# EAGLE design FAL6567g (EAGLE 7.2.0)
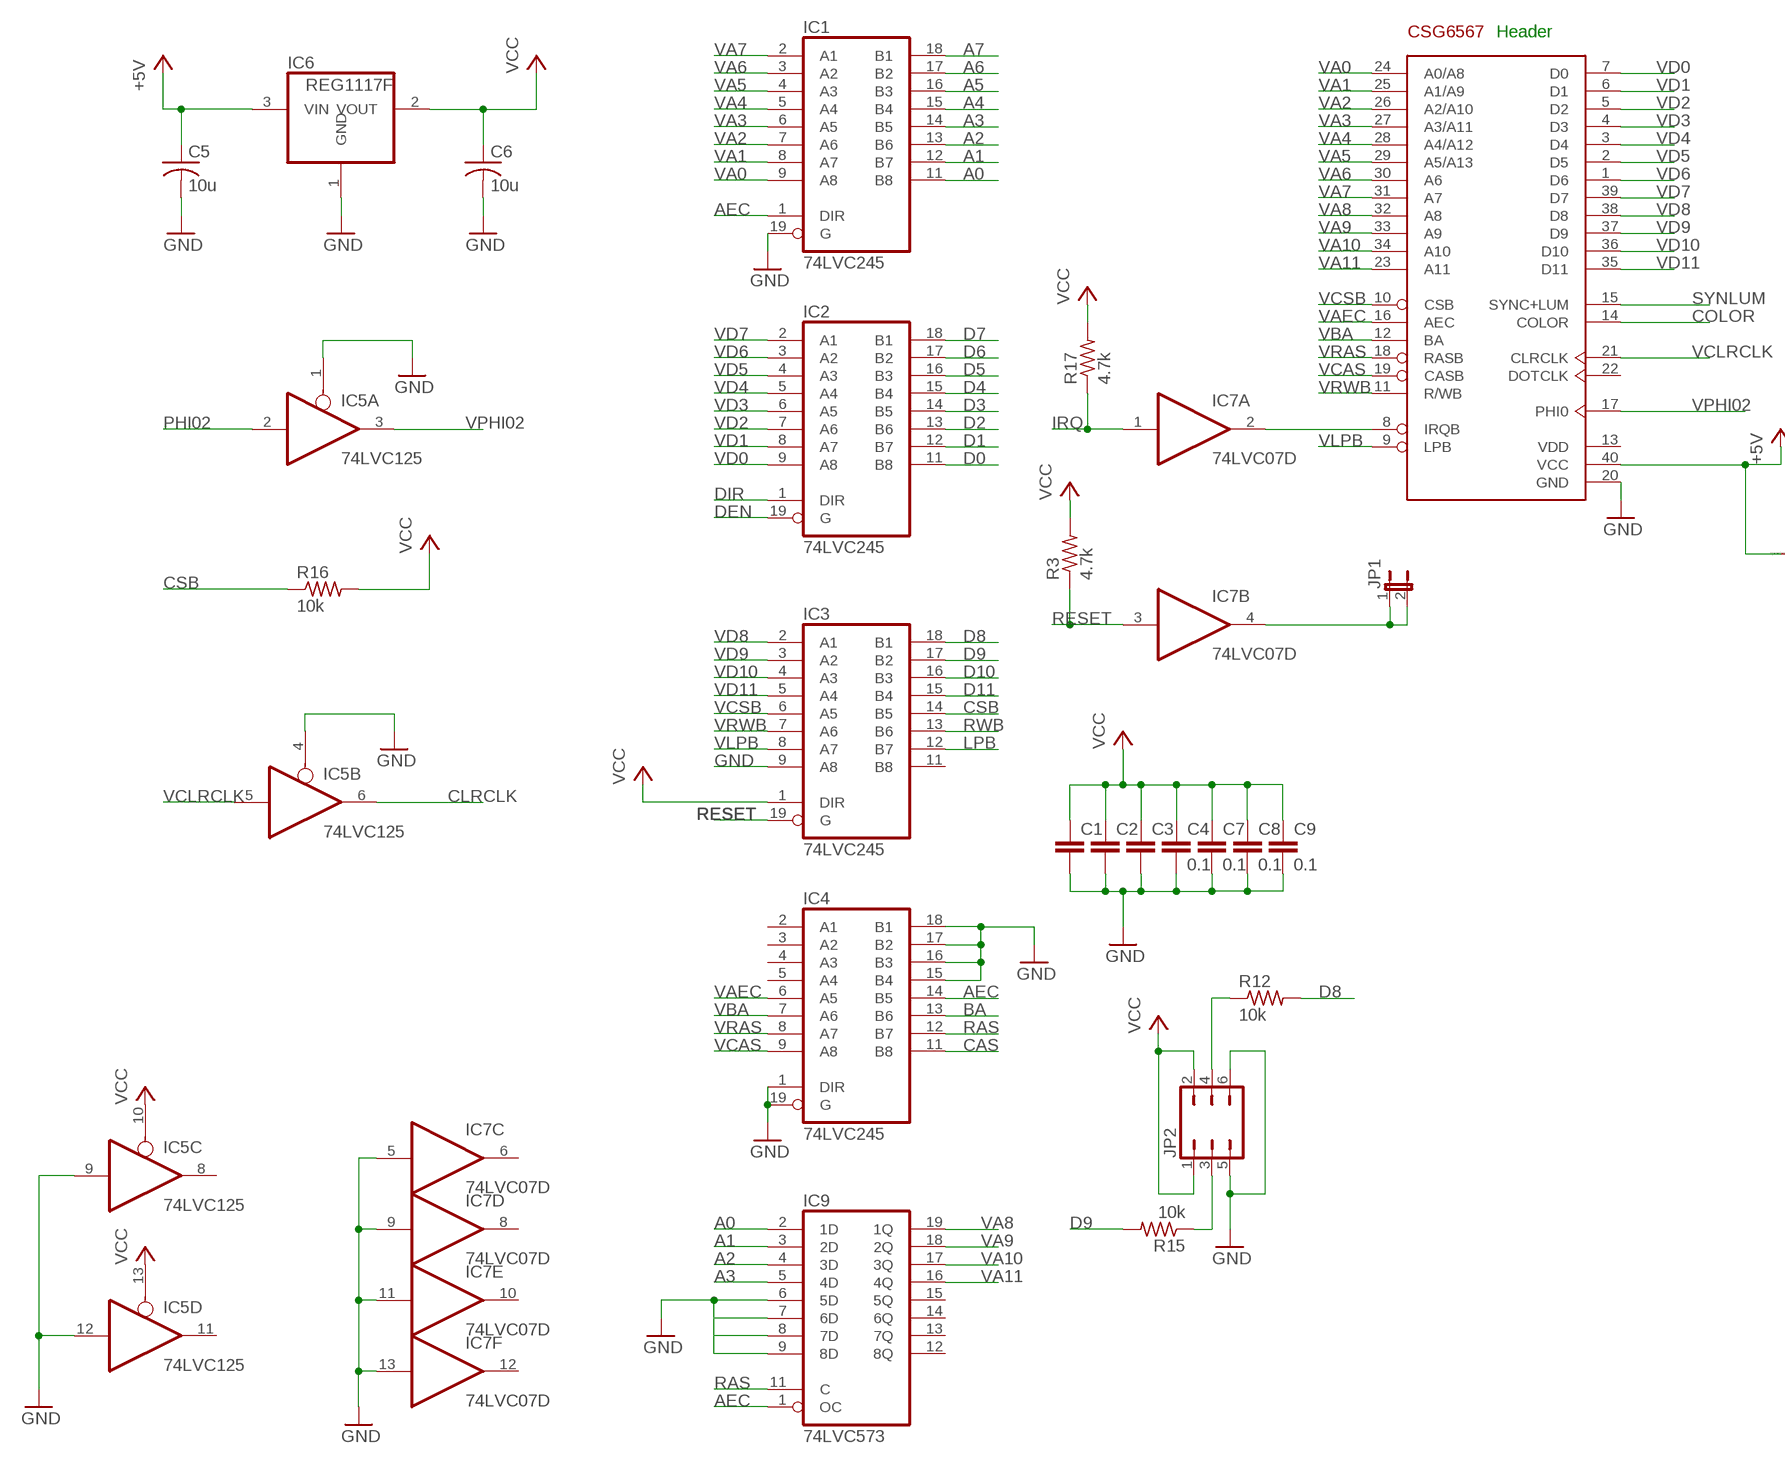
[diagram p0: schematic, sheet 1, part 1 of 2]
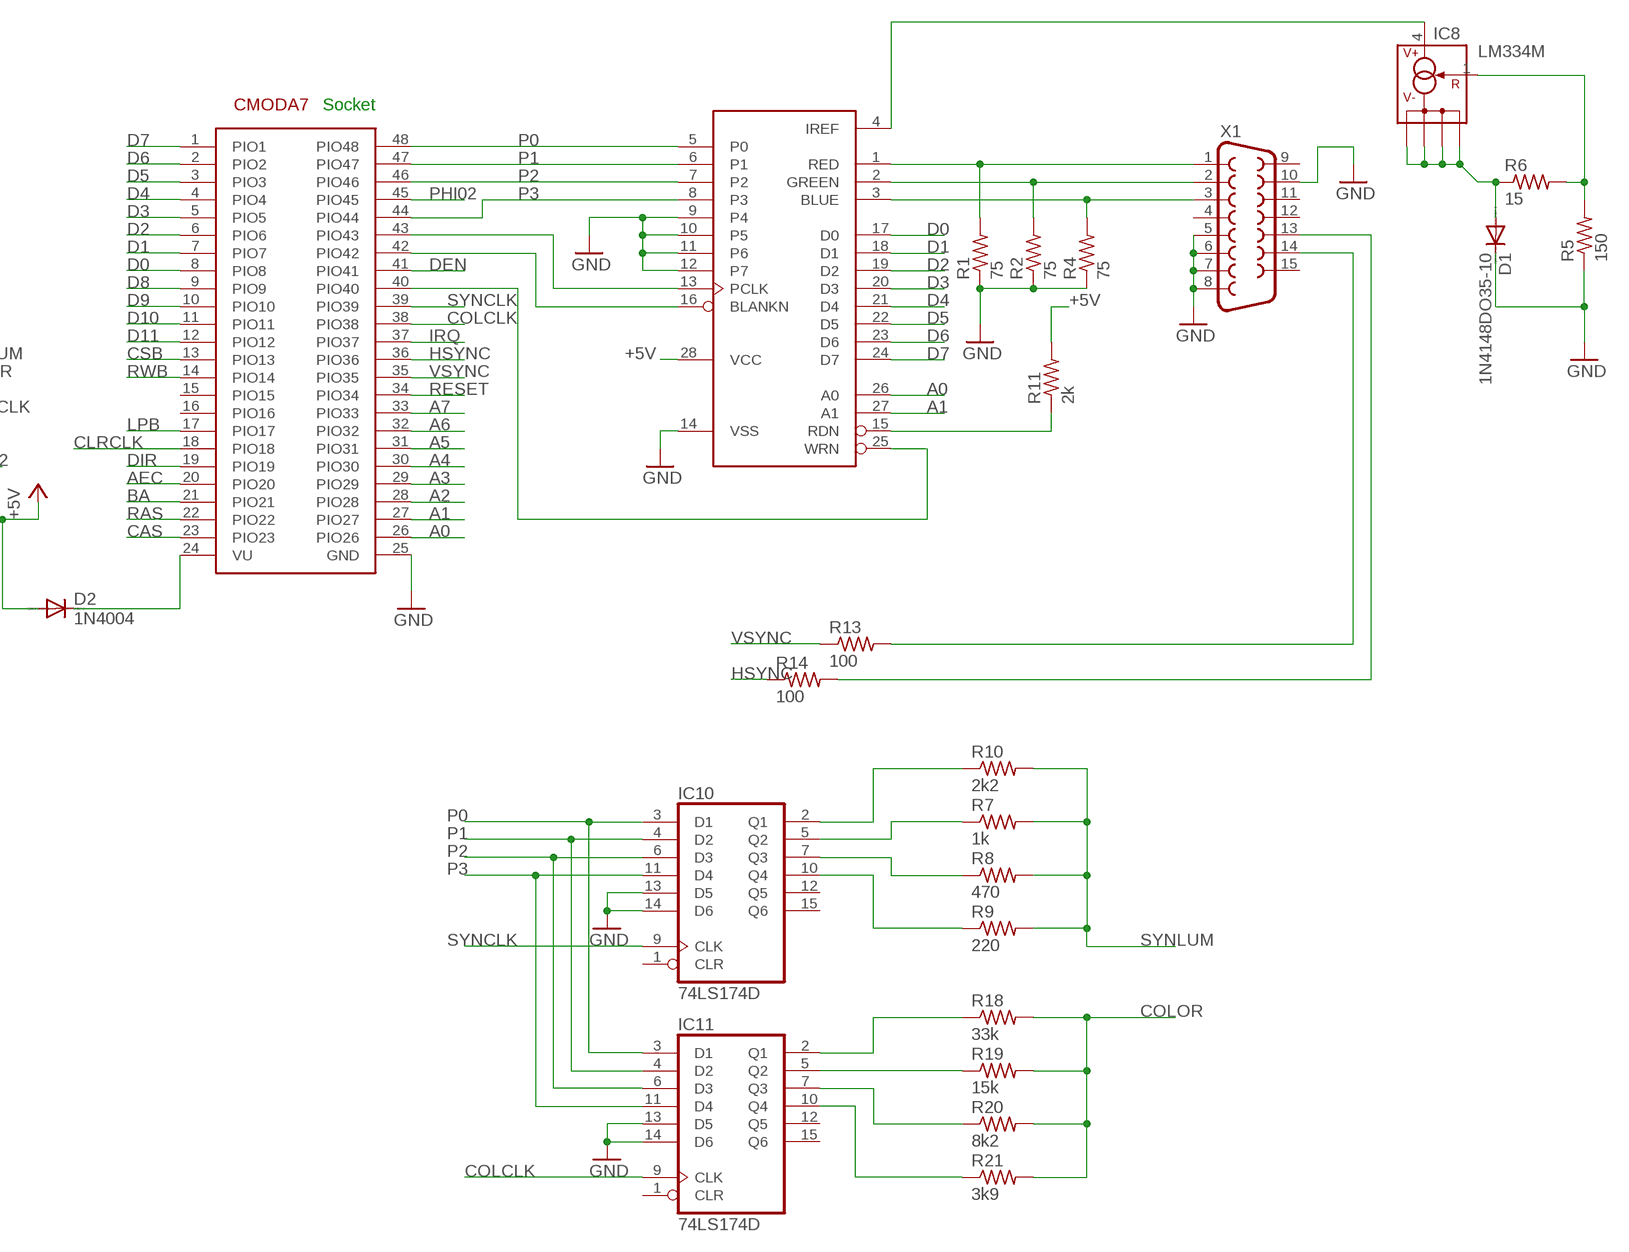
[diagram p1: schematic, sheet 1, part 2 of 2]

## Parts
C1  C-EU050-024X044  [C050-024X044]
C2  C-EU050-024X044  [C050-024X044]
C3  C-EU050-024X044  [C050-024X044]
C4  0.1  C-EU050-024X044  [C050-024X044]
C5  10u  C-USC1206  [C1206]
C6  10u  C-USC1206  [C1206]
C7  0.1  C-EU050-024X044  [C050-024X044]
C8  0.1  C-EU050-024X044  [C050-024X044]
C9  0.1  C-EU050-024X044  [C050-024X044]
D1  1N4148DO35-10  [DO35-10]
D2  1N4004  [DO41-10]
IC1  74LVC245  74LS245DW  [SO20W]
IC2  74LVC245  74LS245DW  [SO20W]
IC3  74LVC245  74LS245DW  [SO20W]
IC4  74LVC245  74LS245DW  [SO20W]
IC5  74LVC125  [SO14]
IC6  REG1117F  [DD-3]
IC7  74LVC07D  74LS07D  [SO14]
IC8  LM334M  [SO08]
IC9  74LVC573  [SO20W]
IC10  74LS174D  [SO16]
IC11  74LS174D  [SO16]
JP1  JP1E  [JP1]
JP2  JP3Q  [JP3Q]
R1  75  R-US_0204/7  [0204/7]
R2  75  R-US_0204/7  [0204/7]
R3  4.7k  R-US_0204/7  [0204/7]
R4  75  R-US_0204/7  [0204/7]
R5  150  R-US_0204/7  [0204/7]
R6  15  R-US_0204/7  [0204/7]
R7  1k  R-US_0204/7  [0204/7]
R8  470  R-US_0204/7  [0204/7]
R9  220  R-US_0204/7  [0204/7]
R10  2k2  R-US_0204/7  [0204/7]
R11  2k  R-US_0204/7  [0204/7]
R12  10k  R-US_0204/7  [0204/7]
R13  100  R-US_0204/7  [0204/7]
R14  100  R-US_0204/7  [0204/7]
R15  10k  R-US_0204/7  [0204/7]
R16  10k  R-US_0204/7  [0204/7]
R17  4.7k  R-US_0204/7  [0204/7]
R18  33k  R-US_0204/7  [0204/7]
R19  15k  R-US_0204/7  [0204/7]
R20  8k2  R-US_0204/7  [0204/7]
R21  3k9  R-US_0204/7  [0204/7]
U$1  CSG6567  [DIP-40]
U$2  CMODA7  [DIL48]
U$3  ADV476  [DIL28-6]
X1  F15HDV  [HDF15V]

## Nets
+5V: C5.1 D2.A IC6.3(VIN) R11.2 U$1.40(VCC) U$3.28(VCC)
A0: IC1.11(B8) IC9.2(1D) U$2.26(PIO26) U$3.26(A0)
A1: IC1.12(B7) IC9.3(2D) U$2.27(PIO27) U$3.27(A1)
A2: IC1.13(B6) IC9.4(3D) U$2.28(PIO28)
A3: IC1.14(B5) IC9.5(4D) U$2.29(PIO29)
A4: IC1.15(B4) U$2.30(PIO30)
A5: IC1.16(B3) U$2.31(PIO31)
A6: IC1.17(B2) U$2.32(PIO32)
A7: IC1.18(B1) U$2.33(PIO33)
AEC: IC1.1(DIR) IC4.14(B5) IC9.1(OC) U$2.20(PIO20)
BA: IC4.13(B6) U$2.21(PIO21)
CAS: IC4.11(B8) U$2.23(PIO23)
CLRCLK: IC5.6(B:O) U$2.18(PIO18)
COLCLK: IC11.9(CLK) U$2.38(PIO38)
COLOR: R18.2 R19.2 R20.2 R21.2 U$1.14(COLOR)
CSB: IC3.14(B5) R16.1 U$2.13(PIO13)
D0: IC2.11(B8) U$2.8(PIO8) U$3.17(D0)
D1: IC2.12(B7) U$2.7(PIO7) U$3.18(D1)
D2: IC2.13(B6) U$2.6(PIO6) U$3.19(D2)
D3: IC2.14(B5) U$2.5(PIO5) U$3.20(D3)
D4: IC2.15(B4) U$2.4(PIO4) U$3.21(D4)
D5: IC2.16(B3) U$2.3(PIO3) U$3.22(D5)
D6: IC2.17(B2) U$2.2(PIO2) U$3.23(D6)
D7: IC2.18(B1) U$2.1(PIO1) U$3.24(D7)
D8: IC3.18(B1) R12.2 U$2.9(PIO9)
D9: IC3.17(B2) R15.2 U$2.10(PIO10)
D10: IC3.16(B3) U$2.11(PIO11)
D11: IC3.15(B4) U$2.12(PIO12)
DEN: IC2.19(G) U$2.41(PIO41)
DIR: IC2.1(DIR) U$2.19(PIO19)
GND: C1.2 C2.2 C3.2 C4.2 C5.2 C6.2 C7.2 C8.2 C9.2 D1.C IC1.19(G) IC3.9(A8) IC4.1(DIR) IC4.15(B4) IC4.16(B3) IC4.17(B2) IC4.18(B1) IC4.19(G) IC5.1(A:OE) IC5.4(B:OE) IC5.9(C:I) IC5.12(D:I) IC6.1(GND) IC7.5(C:I) IC7.9(D:I) IC7.11(E:I) IC7.13(F:I) IC9.6(5D) IC9.9(8D) IC10.13(D5) IC10.14(D6) IC11.13(D5) IC11.14(D6) JP2.5 JP2.6 R1.1 R2.1 R4.1 R5.1 U$1.20(GND) U$2.25(GND) U$3.9(P4) U$3.10(P5) U$3.11(P6) U$3.12(P7) U$3.14(VSS) X1.5 X1.6 X1.7 X1.8 X1.10
HSYNC: R14.1 U$2.36(PIO36)
IRQ: IC7.1(A:I) R17.1 U$2.37(PIO37)
LPB: IC3.12(B7) U$2.17(PIO17)
MD0: JP2.4 R12.1
MD1: JP2.3 R15.1
N$1: IC7.2(A:O) U$1.8(IRQB)
N$2: IC10.2(Q1) R10.1
N$3: IC9.7(6D)
N$4: D2.C U$2.24(VU)
N$5: IC9.8(7D)
N$6: IC10.5(Q2) R7.1
N$7: R1.2 U$3.1(RED) X1.1
N$8: IC7.4(B:O) JP1.1 JP1.2
N$9: IC10.7(Q3) R8.1
N$10: R2.2 U$3.2(GREEN) X1.2
N$11: IC10.10(Q4) R9.1
N$12: R14.2 X1.13
N$13: R13.2 X1.14
N$14: U$2.40(PIO40) U$3.25(WRN)
N$15: R4.2 U$3.3(BLUE) X1.3
N$16: IC8.1(R) R5.2 R6.2
N$17: IC11.2(Q1) R18.1
N$18: IC11.5(Q2) R19.1
N$19: D1.A IC8.2(V-) IC8.3(V-) IC8.6(V-) IC8.7(V-) R6.1
N$21: IC8.4(V+) U$3.4(IREF)
N$23: IC11.7(Q3) R20.1
N$24: U$2.43(PIO43) U$3.13(PCLK)
N$25: U$2.42(PIO42) U$3.16(BLANKN)
N$26: IC11.10(Q4) R21.1
N$28: R11.1 U$3.15(RDN)
P0: IC10.3(D1) IC11.3(D1) U$2.48(PIO48) U$3.5(P0)
P1: IC10.4(D2) IC11.4(D2) U$2.47(PIO47) U$3.6(P1)
P2: IC10.6(D3) IC11.6(D3) U$2.46(PIO46) U$3.7(P2)
P3: IC10.11(D4) IC11.11(D4) U$2.44(PIO44) U$3.8(P3)
PHI02: IC5.2(A:I) U$2.45(PIO45)
RAS: IC4.12(B7) IC9.11(C) U$2.22(PIO22)
RESET: IC3.19(G) IC7.3(B:I) R3.1 U$2.34(PIO34)
RWB: IC3.13(B6) U$2.14(PIO14)
SYNCLK: IC10.9(CLK) U$2.39(PIO39)
SYNLUM: R7.2 R8.2 R9.2 R10.2 U$1.15(SYNC+LUM)
VA0: IC1.9(A8) U$1.24(A0/A8)
VA1: IC1.8(A7) U$1.25(A1/A9)
VA2: IC1.7(A6) U$1.26(A2/A10)
VA3: IC1.6(A5) U$1.27(A3/A11)
VA4: IC1.5(A4) U$1.28(A4/A12)
VA5: IC1.4(A3) U$1.29(A5/A13)
VA6: IC1.3(A2) U$1.30(A6)
VA7: IC1.2(A1) U$1.31(A7)
VA8: IC9.19(1Q) U$1.32(A8)
VA9: IC9.18(2Q) U$1.33(A9)
VA10: IC9.17(3Q) U$1.34(A10)
VA11: IC9.16(4Q) U$1.23(A11)
VAEC: IC4.6(A5) U$1.16(AEC)
VBA: IC4.7(A6) U$1.12(BA)
VCAS: IC4.9(A8) U$1.19(CASB)
VCC: C1.1 C2.1 C3.1 C4.1 C6.1 C7.1 C8.1 C9.1 IC3.1(DIR) IC5.10(C:OE) IC5.13(D:OE) IC6.2(VOUT) JP2.1 JP2.2 R3.2 R16.2 R17.2
VCLRCLK: IC5.5(B:I) U$1.21(CLRCLK)
VCSB: IC3.6(A5) U$1.10(CSB)
VD0: IC2.9(A8) U$1.7(D0)
VD1: IC2.8(A7) U$1.6(D1)
VD2: IC2.7(A6) U$1.5(D2)
VD3: IC2.6(A5) U$1.4(D3)
VD4: IC2.5(A4) U$1.3(D4)
VD5: IC2.4(A3) U$1.2(D5)
VD6: IC2.3(A2) U$1.1(D6)
VD7: IC2.2(A1) U$1.39(D7)
VD8: IC3.2(A1) U$1.38(D8)
VD9: IC3.3(A2) U$1.37(D9)
VD10: IC3.4(A3) U$1.36(D10)
VD11: IC3.5(A4) U$1.35(D11)
VLPB: IC3.8(A7) U$1.9(LPB)
VPHI02: IC5.3(A:O) U$1.17(PHI0)
VRAS: IC4.8(A7) U$1.18(RASB)
VRWB: IC3.7(A6) U$1.11(R/WB)
VSYNC: R13.1 U$2.35(PIO35)
Unconnected: IC3.11(B8) IC4.2(A1) IC4.3(A2) IC4.4(A3) IC4.5(A4) IC5.8(C:O) IC5.11(D:O) IC7.6(C:O) IC7.8(D:O) IC7.10(E:O) IC7.12(F:O) IC9.12(8Q) IC9.13(7Q) IC9.14(6Q) IC9.15(5Q) IC10.1(CLR) IC10.12(Q5) IC10.15(Q6) IC11.1(CLR) IC11.12(Q5) IC11.15(Q6) U$1.22(DOTCLK) U$2.15(PIO15) U$2.16(PIO16) X1.4 X1.9 X1.11 X1.12 X1.15

## Notes on the sheet
- Header
- Socket

## Power pins joined to a net without a drawn wire
GND: IC1.10(GND) IC2.10(GND) IC3.10(GND) IC4.10(GND) IC5.7(P:GND) IC7.7(P:GND) IC9.10(GND) IC10.8(GND) IC11.8(GND)
VCC: IC1.20(VCC) IC2.20(VCC) IC3.20(VCC) IC4.20(VCC) IC5.14(P:VCC) IC7.14(P:VCC) IC9.20(VCC) IC10.16(VCC) IC11.16(VCC)
VDD: U$1.13(VDD)

## Library data of the parts
C1-C4 C7-C9 = resistor:C-EU: CAPACITOR, European symbol
C5 C6 = resistor:C-US: CAPACITOR, American symbol
D1 = diode:1N4148: DIODE high speed (Philips)
D2 = diode:1N4004: DIODE general purpose rectifier, 1 A
IC1-IC4 = FT74xx:74*245: Octal BUS TRANSCEIVER, 3-state
IC5 = FT74xx:74*125: Quad bus BUFFER, 3-state
IC6 = burr-brown:REG1117: 800mA and 1A Low Dropout (LDO) Positive Regulator 1.8V, 2.5V, 2.85V, 3.3V, 5V, and Adj; MF: TEXAS INSTRUMENTS; MPN: REG1117FAKTTT; OC_FARNELL: 1296120; OC_NEWARK: 87H2562
IC7 = FT74xx:74*07: Hex BUFFER, open collector high-voltage output
IC8 = linear:LM334*: 3-Terminal Adjustable Current Sources Source: www.national.com/pf/LM/LM334.html | LM134.pdf
IC9 = FT74xx:74*573: 8-bit D latch BUS DRIVER
IC10 IC11 = FT74xx:74*174: Hex D type FLIP FLOP, clear
JP1 = jumper:JP1E: JUMPER
JP2 = jumper:JP3Q: JUMPER
R1-R21 = resistor:R-US_: RESISTOR, American symbol
U$1 = 65xxx:CSG6567
U$2 = FT74xx:CMODA7
U$3 = FT74xx:ADV476: color palette
X1 = con-subd:F15: SUB-D; OC_FARNELL: unknown; OC_NEWARK: unknown

## Board
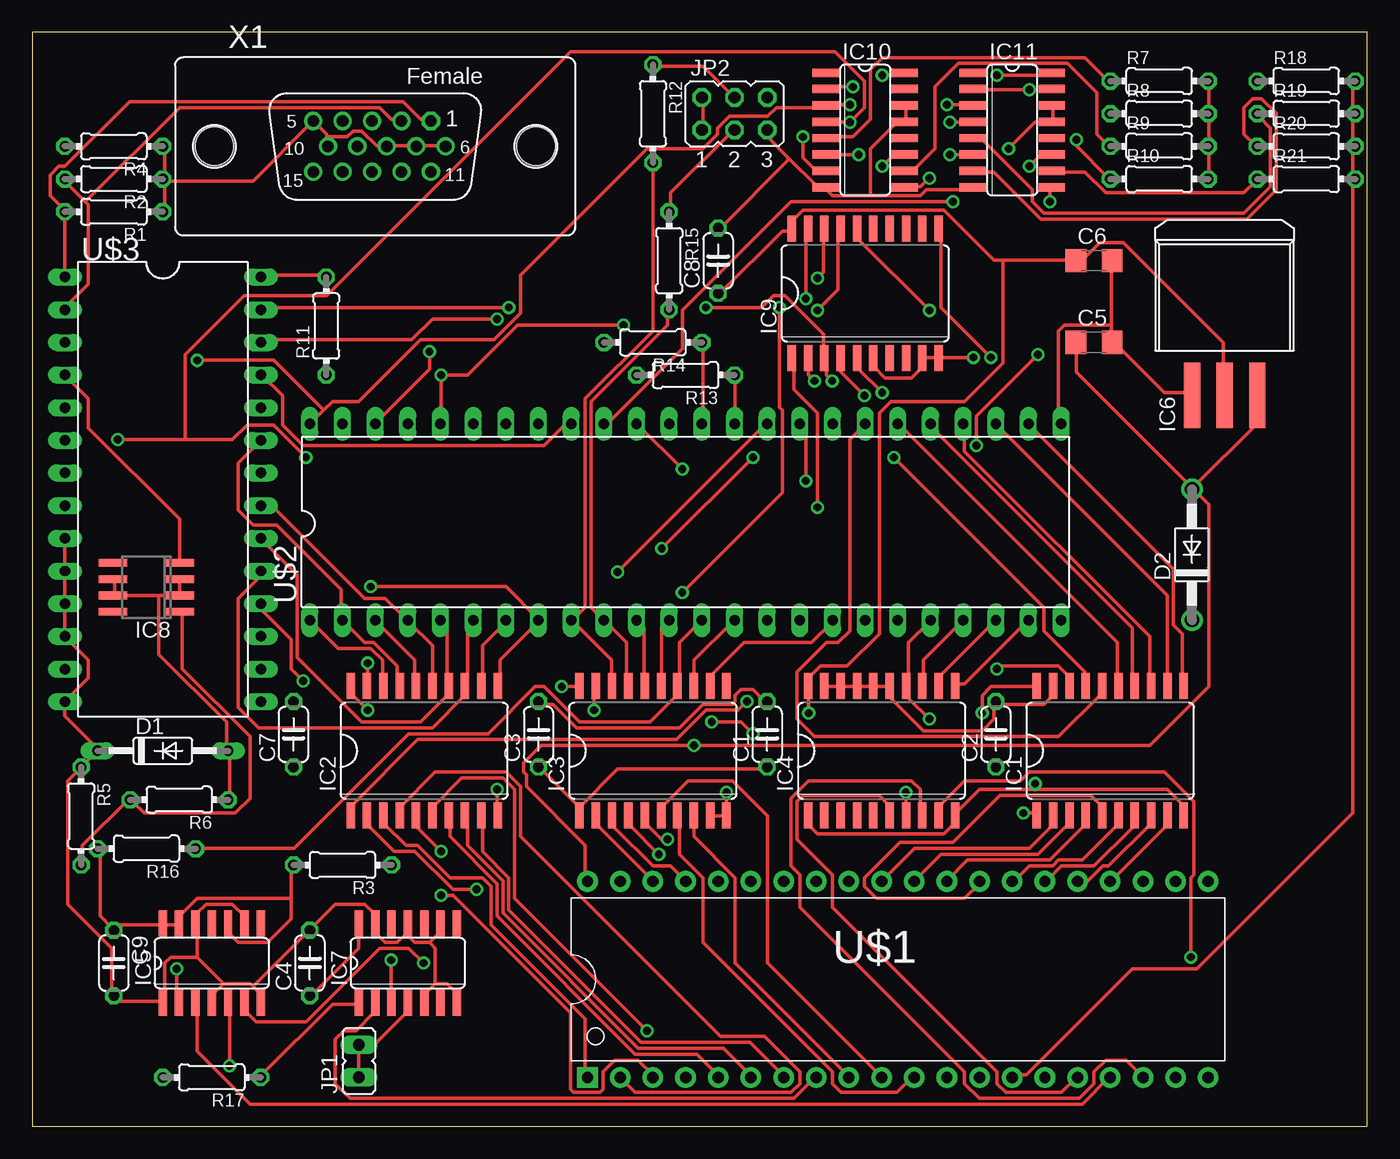
[diagram p2: board, top side]
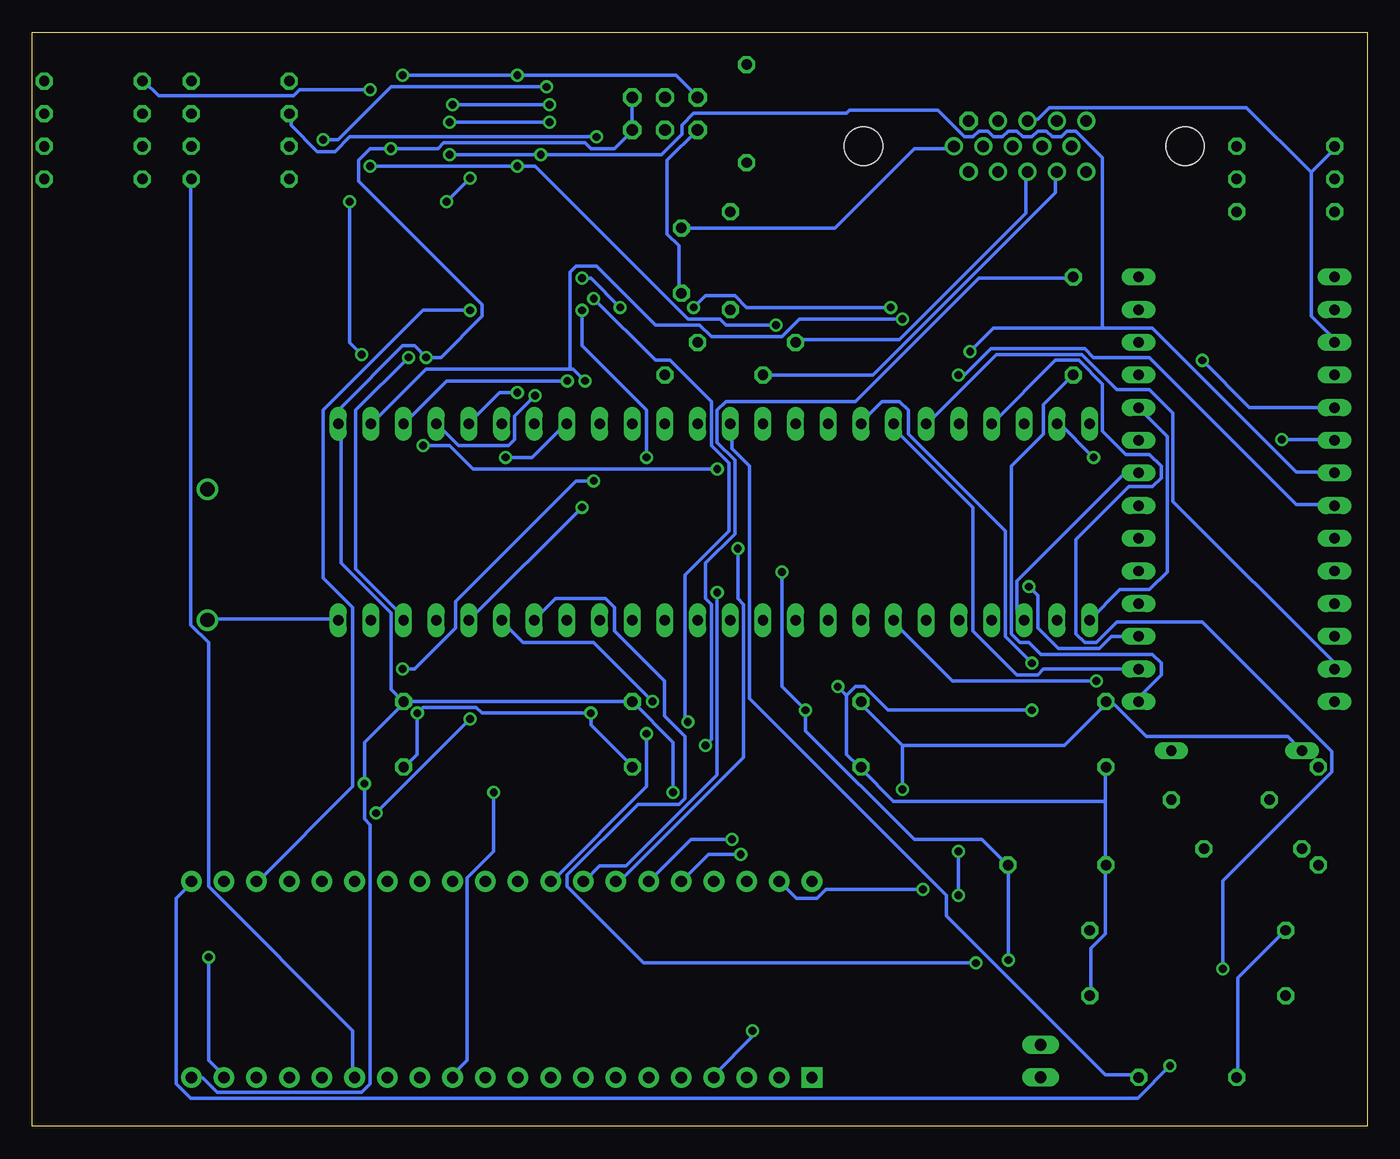
[diagram p3: board, bottom side, seen from below]

Size 103.81 x 85.08 mm. Coordinates in mm from the lower left corner, seen from the top.
Outline: 0,0 103.81,0 103.81,85.08 0,85.08 0,0
Copper layers (1*16): Top 0.035mm / dielectric 1.5mm / Bottom 0.035mm
Design rules "default": minimum track width 10mil, minimum drill 24mil, track to track 8mil, track to pad 8mil, pad to pad 8mil, via to via 8mil, smd to smd 8mil, copper to edge 40mil, drill to drill 8mil, minimum pad ring 10mil, minimum via ring 8mil, stop-mask expansion 4mil, vias tented up to drill 0mil, thermal gap 10mil

### Footprints (pad centres in the part's own frame; a part is rotated, then mirrored left to right if it is on the bottom)
C050-024X044 = drill 0.813 octagon: 1 -2.54,0; 2 2.54,0
C1206 = smd 1.6 x 1.8: 1 -1.4,0; 2 1.4,0
DO35-10 = drill 0.813 long: A 5.08,0; C -5.08,0
DO41-10 = drill 1.118: A 5.08,0; C -5.08,0
SO20W = smd 0.66 x 2.032: 1 -5.715,-5.029; 2 -4.445,-5.029; 3 -3.175,-5.029; 4 -1.905,-5.029; 5 -0.635,-5.029; 6 0.635,-5.029; 7 1.905,-5.029; 8 3.175,-5.029; 9 4.445,-5.029; 10 5.715,-5.029; 11 5.715,5.029; 12 4.445,5.029; 13 3.175,5.029; 14 1.905,5.029; 15 0.635,5.029; 16 -0.635,5.029; 17 -1.905,5.029; 18 -3.175,5.029; 19 -4.445,5.029; 20 -5.715,5.029
SO14 = smd 0.66 x 2.032: 1 -3.81,-3.073; 2 -2.54,-3.073; 3 -1.27,-3.073; 4 0,-3.073; 5 1.27,-3.073; 6 2.54,-3.073; 7 3.81,-3.073; 8 3.81,3.073; 9 2.54,3.073; 10 1.27,3.073; 11 0,3.073; 12 -1.27,3.073; 13 -2.54,3.073; 14 -3.81,3.073
DD-3 = smd 1.27 x 5.08: 1 -2.54,-7.938; 2 0,-7.938; 3 2.54,-7.938
SO08 = smd 0.6 x 2.2: 1 -1.905,-2.6; 2 -0.635,-2.6; 3 0.635,-2.6; 4 1.905,-2.6; 5 1.905,2.6; 6 0.635,2.6; 7 -0.635,2.6; 8 -1.905,2.6
SO16 = smd 0.66 x 2.032: 1 -4.445,-3.073; 2 -3.175,-3.073; 3 -1.905,-3.073; 4 -0.635,-3.073; 5 0.635,-3.073; 6 1.905,-3.073; 7 3.175,-3.073; 8 4.445,-3.073; 9 4.445,3.073; 10 3.175,3.073; 11 1.905,3.073; 12 0.635,3.073; 13 -0.635,3.073; 14 -1.905,3.073; 15 -3.175,3.073; 16 -4.445,3.073
JP1 = drill 0.914 long: 1 0,-1.27; 2 0,1.27
JP3Q = drill 0.914 octagon: 1 -2.54,-1.27; 2 -2.54,1.27; 3 0,-1.27; 4 0,1.27; 5 2.54,-1.27; 6 2.54,1.27
0204/7 = drill 0.813 octagon: 1 -3.81,0; 2 3.81,0
DIP-40 = drill 0.889 pad 1.6 square: 1 -22.86,-7.62 | drill 0.889 pad 1.6: 2 -20.32,-7.62; 3 -17.78,-7.62; 4 -15.24,-7.62; 5 -12.7,-7.62; 6 -10.16,-7.62; 7 -7.62,-7.62; 8 -5.08,-7.62; 9 -2.54,-7.62; 10 0,-7.62; 11 2.54,-7.62; 12 5.08,-7.62; 13 7.62,-7.62; 14 10.16,-7.62; 15 12.7,-7.62; 16 15.24,-7.62; 17 17.78,-7.62; 18 20.32,-7.62; 19 22.86,-7.62; 20 25.4,-7.62; 21 25.4,7.62; 22 22.86,7.62; 23 20.32,7.62; 24 17.78,7.62; 25 15.24,7.62; 26 12.7,7.62; 27 10.16,7.62; 28 7.62,7.62; 29 5.08,7.62; 30 2.54,7.62; 31 0,7.62; 32 -2.54,7.62; 33 -5.08,7.62; 34 -7.62,7.62; 35 -10.16,7.62; 36 -12.7,7.62; 37 -15.24,7.62; 38 -17.78,7.62; 39 -20.32,7.62; 40 -22.86,7.62
DIL48 = drill 0.813 long: 1 -29.21,-7.62; 2 -26.67,-7.62; 3 -24.13,-7.62; 4 -21.59,-7.62; 5 -19.05,-7.62; 6 -16.51,-7.62; 7 -13.97,-7.62; 8 -11.43,-7.62; 9 -8.89,-7.62; 10 -6.35,-7.62; 11 -3.81,-7.62; 12 -1.27,-7.62; 13 1.27,-7.62; 14 3.81,-7.62; 15 6.35,-7.62; 16 8.89,-7.62; 17 11.43,-7.62; 18 13.97,-7.62; 19 16.51,-7.62; 20 19.05,-7.62; 21 21.59,-7.62; 22 24.13,-7.62; 23 26.67,-7.62; 24 29.21,-7.62; 25 29.21,7.62; 26 26.67,7.62; 27 24.13,7.62; 28 21.59,7.62; 29 19.05,7.62; 30 16.51,7.62; 31 13.97,7.62; 32 11.43,7.62; 33 8.89,7.62; 34 6.35,7.62; 35 3.81,7.62; 36 1.27,7.62; 37 -1.27,7.62; 38 -3.81,7.62; 39 -6.35,7.62; 40 -8.89,7.62; 41 -11.43,7.62; 42 -13.97,7.62; 43 -16.51,7.62; 44 -19.05,7.62; 45 -21.59,7.62; 46 -24.13,7.62; 47 -26.67,7.62; 48 -29.21,7.62
DIL28-6 = drill 0.813 long: 1 -16.51,-7.62; 2 -13.97,-7.62; 3 -11.43,-7.62; 4 -8.89,-7.62; 5 -6.35,-7.62; 6 -3.81,-7.62; 7 -1.27,-7.62; 8 1.27,-7.62; 9 3.81,-7.62; 10 6.35,-7.62; 11 8.89,-7.62; 12 11.43,-7.62; 13 13.97,-7.62; 14 16.51,-7.62; 15 16.51,7.62; 16 13.97,7.62; 17 11.43,7.62; 18 8.89,7.62; 19 6.35,7.62; 20 3.81,7.62; 21 1.27,7.62; 22 -1.27,7.62; 23 -3.81,7.62; 24 -6.35,7.62; 25 -8.89,7.62; 26 -11.43,7.62; 27 -13.97,7.62; 28 -16.51,7.62
HDF15V = drill 0.9 octagon: 1 4.329,1.98 | drill 0.9: 2 2.043,1.98; 3 -0.243,1.98; 4 -2.529,1.98; 5 -4.815,1.98; 6 5.472,0; 7 3.186,0; 8 0.9,0; 9 -1.386,0; 10 -3.672,0; 11 4.329,-1.98; 12 2.043,-1.98; 13 -0.243,-1.98; 14 -2.529,-1.98; 15 -4.815,-1.98 | hole 3: -12.5,0; 12.5,0

### Placement (x,y rotation side)
C1  57.15,30.48 90 top
C2  74.93,30.48 90 top
C3  39.37,30.48 90 top
C4  21.59,12.7 90 top
C5  82.55,60.96 0 top
C6  82.55,67.31 0 top
C7  20.32,30.48 90 top
C8  53.34,67.31 90 top
C9  6.35,12.7 270 top
D1  10.16,29.21 0 top
D2  90.17,44.45 90 top
DRILEGEND  [DRILEGEND]  0,-7.62 0 top  (outside the outline)
IC1  83.82,29.21 0 top
IC2  30.48,29.21 0 top
IC3  48.26,29.21 0 top
IC4  66.04,29.21 0 top
IC5  13.97,12.7 0 top
IC6  92.71,64.77 0 top
IC7  29.21,12.7 0 top
IC8  8.89,41.91 90 top
IC9  64.77,64.77 0 top
IC10  64.77,77.47 270 top
IC11  76.2,77.47 270 top
JP1  25.4,5.08 0 top
JP2  54.61,78.74 0 top
R1  6.35,71.12 180 top
R2  6.35,73.66 180 top
R3  24.13,20.32 180 top
R4  6.35,76.2 180 top
R5  3.81,24.13 270 top
R6  11.43,25.4 180 top
R7  87.63,81.28 0 top
R8  87.63,78.74 0 top
R9  87.63,76.2 0 top
R10  87.63,73.66 0 top
R11  22.86,62.23 90 top
R12  48.26,78.74 270 top
R13  50.8,58.42 180 top
R14  48.26,60.96 180 top
R15  49.53,67.31 270 top
R16  8.89,21.59 180 top
R17  13.97,3.81 180 top
R18  99.06,81.28 0 top
R19  99.06,78.74 0 top
R20  99.06,76.2 0 top
R21  99.06,73.66 0 top
U$1  66.04,11.43 0 top
U$2  50.8,46.99 0 top
U$3  10.16,49.53 270 top
X1  26.67,76.2 0 top

### Tracks (layer width: path | path; a pad name or v marks a point on that pad's centre or on a via)
+5V  (via drill 0.61)
  Top 0.254: U$3.28 17.86,66.19 22.66,66.19 R11.2 | C5.1 81.18,60.94 81.18,58.65 90.09,49.73 D2.A | U$1.40 43,19.1 43,21.84 38.43,26.42 38.43,27.33 38.2,27.56 38.2,28.25 39.57,29.62 v51.46,29.62 86.89,29.62 91.47,34.19 91.47,48.36 90.32,49.51 D2.A | IC6.3 95.12,56.82 95.12,54.53 90.32,49.73 D2.A
  Bottom 0.254: v51.46,29.62 51,30.07 51,40.59 51.46,41.05 51.46,43.79 49.17,46.08 49.17,51.79 50.55,53.16 50.55,55.68 49.86,56.36 39.8,56.36 30.2,65.96 22.88,65.96 R11.2
A0  (via drill 0.61)
  Top 0.254: v60.83,57.96 60.38,58.42 60.38,59.56 IC9.2 | IC1.11 89.41,34.42 89.41,38.3 88.72,38.99 88.72,43.33 77.52,54.53 U$2.26 | v36.14,62.76 31.11,62.76 29.52,61.16 17.86,61.16 U$3.26
  Bottom 0.254: v60.83,57.96 61.75,58.88 61.98,58.88 | 61.98,58.88 73.18,58.88 77.29,54.76 U$2.26 | v36.14,62.76 44.14,62.76 45.52,61.39 51,61.39 51.92,62.31 55.35,62.31 59.92,66.88 61.52,66.88 61.98,66.42 61.98,58.88
A1  (via drill 0.61)
  Top 0.254: IC1.12 88.27,41.28 U$2.27 | v62.2,57.96 61.75,58.42 61.75,59.56 IC9.3 61.52,59.79 61.52,61.62 58.55,64.59 57.63,64.59 56.72,63.68 v52.38,63.68 | v37.06,63.68 17.86,63.68 U$3.27
  Bottom 0.254: v62.2,57.96 71.58,57.96 U$2.27 | v37.06,63.68 48.26,63.68 49.17,64.59 51.46,64.59 v52.38,63.68
A2  (via drill 0.61)
  Top 0.254: IC1.13 86.89,34.42 86.89,38.08 72.49,52.48 72.49,54.53 U$2.28 | v64.72,56.82 62.89,58.65 62.89,59.56 IC9.4
  Bottom 0.254: v64.72,56.82 66.32,55.22 66.32,53.39 66.78,52.93 70.66,52.93 72.26,54.53 U$2.28
A3  (via drill 0.61)
  Top 0.254: IC1.14 85.52,34.42 85.52,38.76 69.75,54.53 U$2.29 | v66.09,57.05 64.26,58.88 64.26,59.56 IC9.5
  Bottom 0.254: v66.09,57.05 67.46,57.05 69.75,54.76 U$2.29
A4
  Top 0.254: IC1.15 84.38,34.42 84.38,37.62 67.46,54.53 U$2.30
A5
  Top 0.254: IC1.16 83.01,34.19 83.01,33.5 79.81,30.3 60.83,30.3 59.46,31.67 59.46,35.33 61.75,37.62 62.66,37.62 63.58,38.53 63.58,53.39 64.72,54.53 U$2.31
A6  (via drill 0.61)
  Top 0.254: v67.01,52.02 78.66,40.36 78.66,38.53 81.86,35.33 81.86,34.42 IC1.17
  Bottom 0.254: v67.01,52.02 64.95,52.02 62.43,54.53 U$2.32
A7  (via drill 0.61)
  Top 0.254: v75.01,35.56 75.23,35.79 79.81,35.79 80.49,35.1 80.49,34.42 IC1.18 | v60.15,50.19 60.15,54.08 59.69,54.53 U$2.33
  Bottom 0.254: v75.01,35.56 74.09,35.56 70.89,38.76 70.89,40.82 61.52,50.19 v60.15,50.19
AEC  (via drill 0.61)
  Top 0.254: U$2.20 69.75,39.22 68.15,37.62 68.15,34.42 IC4.14 68.15,34.19 68.15,33.27 v69.75,31.67 | v77.06,24.36 77.98,24.36 IC1.1 | v61.06,48.13 61.06,55.45 59.23,57.28 59.23,59.56 IC9.1
  Bottom 0.254: v69.75,31.67 v77.06,24.36 | v61.06,48.13 69.75,39.45 U$2.20
BA
  Top 0.254: IC4.13 69.29,34.42 69.29,36.25 72.26,39.22 U$2.21
CAS
  Top 0.254: IC4.11 71.81,34.42 72.49,34.42 77.29,39.22 U$2.23
CLRCLK  (via drill 0.61)
  Top 0.254: v30.43,12.7 29.29,13.84 27,13.84 21.29,8.13 17.4,8.13 16.71,8.81 16.71,9.5 IC5.6
  Bottom 0.254: v30.43,12.7 56.26,12.7 62.2,18.64 62.2,19.56 56.72,25.04 53.52,25.04 53.06,25.5 53.06,30.3 54.66,31.9 54.66,34.65 58.55,38.53 58.55,40.36 59.23,41.05 63.12,41.05 64.72,39.45 U$2.18
COLCLK  (via drill 0.61)
  Top 0.254: v79.12,71.91 79.12,72.82 IC11.9 | v78.21,60.02 73.41,55.22 v73.41,52.93 | v50.55,51.11 47.12,54.53 U$2.38
  Bottom 0.254: v79.12,71.91 79.12,60.94 v78.21,60.02 | v73.41,52.93 71.35,52.93 69.52,51.11 v50.55,51.11
COLOR
  Top 0.254: R18.2 102.67,81.28 102.67,78.77 R19.2 102.67,78.54 102.67,76.25 R20.2 102.67,76.02 102.67,73.74 R21.2 102.67,73.51 102.67,24.36 90.55,12.24 85.52,12.24 77.29,4.01 76.38,4.01 U$1.14
CSB
  Top 0.254: U$2.13 50.32,37.62 50.32,34.42 IC3.14 50.09,34.19 50.09,33.5 48.03,31.45 42.55,31.45 39.8,34.19 39.12,34.19 35.46,30.53 29.29,30.53 20.37,21.61 12.83,21.61 R16.1
D0  (via drill 0.61)
  Top 0.254: IC2.11 36.37,34.42 36.37,36.25 39.34,39.22 U$2.8 39.34,39.45 36.83,41.96 v26.31,41.96
  Bottom 0.254: v26.31,41.96 25.63,41.28 25.63,38.76 24.03,37.16 20.83,37.16 19.91,38.08 17.86,38.08 U$3.17
D1  (via drill 0.61)
  Top 0.254: IC2.12 35,34.42 35,37.39 36.83,39.22 U$2.7 | v21.06,34.65 20.14,35.56 20.14,37.85 17.86,40.13 17.86,40.59 U$3.18
  Bottom 0.254: v21.06,34.65 32.26,34.65 36.83,39.22 U$2.7
D2
  Top 0.254: U$2.6 34.09,39.22 33.86,38.99 33.86,34.42 IC2.13 33.63,34.19 33.63,33.5 31.11,30.99 17.63,30.99 16.03,32.59 16.03,41.05 17.63,42.65 17.63,43.1 U$3.19
D3
  Top 0.254: U$2.5 31.8,39.22 32.26,38.76 32.26,34.42 IC2.14 32.26,34.19 32.26,33.5 30.2,31.45 25.63,31.45 20.6,36.47 20.6,42.88 17.86,45.62 U$3.20
D4
  Top 0.254: IC2.15 31.11,37.39 29.29,39.22 U$2.4 29.06,39.45 27.46,41.05 25.86,41.05 18.77,48.13 17.86,48.13 U$3.21
D5
  Top 0.254: IC2.16 29.74,34.42 29.74,36.25 26.77,39.22 U$2.3
  Bottom 0.254: U$3.22 17.86,50.65 19,50.65 27.23,42.42 27.23,39.9 26.77,39.45 U$2.3
D6
  Top 0.254: IC2.17 28.37,34.42 28.37,35.79 26.54,37.62 25.86,37.62 24.26,39.22 U$2.2 24.03,39.45 24.03,41.73 19,46.76 17.17,46.76 16.03,47.9 16.03,51.56 17.63,53.16 U$3.23
D7
  Top 0.254: U$2.1 23.8,37.16 26.31,37.16 27.23,36.25 27.23,34.42 IC2.18
  Bottom 0.254: U$2.1 19.23,41.73 16.94,41.73 15.57,43.1 15.57,53.62 17.63,55.68 U$3.24
D8
  Top 0.254: IC3.18 45.06,34.42 45.06,36.25 42.09,39.22 U$2.9 42.09,39.45 43,40.36 43,56.59 48.26,61.85 R12.2
D9
  Top 0.254: IC3.17 46.2,34.42 46.2,37.62 U$2.10 43.46,40.36 43.46,56.36 49.4,62.31 49.4,63.45 R15.2
D10
  Top 0.254: IC3.16 47.57,34.42 47.57,38.76 47.12,39.22 U$2.11
D11
  Top 0.254: IC3.15 48.95,34.42 48.95,38.76 49.4,39.22 U$2.12
DEN  (via drill 0.61)
  Top 0.254: v26.09,36.02 26.09,34.42 IC2.19
  Bottom 0.254: v26.09,36.02 28.14,38.08 28.14,46.3 35.69,53.85 35.69,55.68 36.37,56.36 37.74,56.36 39.34,54.76 U$2.41
DIR  (via drill 0.61)
  Top 0.254: v55.57,33.05 54.89,32.36 52.38,32.36 50.09,30.07 29.97,30.07 24.94,25.04 24.94,24.36 IC2.1
  Bottom 0.254: v55.57,33.05 60.15,37.62 65.63,37.62 67.23,39.22 U$2.19
GND  (via drill 0.61)
  Top 0.254: 10.31,73.51 10.31,71.22 R1.1 | R4.1 10.31,76.02 10.31,73.74 R2.1 10.31,73.51 | 22.88,76.94 22.88,77.16 21.97,78.08 X1.5 21.74,78.08 17.17,73.51 10.31,73.51 | 22.88,76.94 22.88,76.25 X1.10 | X1.6 32.03,76.25 29.97,76.25 X1.7 29.74,76.25 27.69,76.25 X1.8 27.46,76.25 26.77,76.25 25.63,77.39 24.94,77.39 24.49,76.94 22.88,76.94 | IC11.14 79.35,79.22 79.35,78.31 IC11.13 79.12,78.08 77.98,78.08 v75.92,76.02 | IC10.14 67.92,79.22 67.92,78.31 IC10.13 67.69,78.08 67.23,78.08 65.18,76.02 65.18,72.36 | 58.78,75.34 57.17,76.94 57.17,77.39 JP2.5 | 58.78,75.34 61.06,73.05 61.52,73.05 IC10.8 61.75,72.82 62.2,72.36 65.18,72.36 | 65.18,72.36 69.06,72.36 69.52,72.82 72.95,72.82 IC11.8 | 58.78,75.34 58.78,75.11 53.52,69.85 C8.2 | 31.34,11.1 30.66,10.41 30.66,9.73 IC7.5 | 31.34,11.1 32.26,11.1 32.94,10.41 32.94,9.73 IC7.7 | 29.06,14.99 28.37,14.3 27.46,14.3 26.77,14.99 26.77,15.67 IC7.13 26.54,15.9 26.54,16.59 25.86,17.27 23.57,17.27 21.74,15.44 C4.2 21.51,15.21 17.17,10.87 | 29.06,14.99 29.06,15.67 IC7.11 29.06,14.99 | 30.89,14.3 31.57,14.99 31.57,15.67 IC7.9 | 30.89,14.3 29.74,14.3 29.06,14.99 | 31.34,11.1 31.34,13.84 30.89,14.3 | IC5.4 13.97,10.18 14.88,11.1 | 14.88,11.1 16.94,11.1 17.17,10.87 | 17.17,10.87 17.63,10.41 17.63,9.73 IC5.7 | 12.83,13.16 12.83,15.67 IC5.12 12.83,15.9 12.83,16.59 13.51,17.27 15.57,17.27 16.48,16.36 16.48,15.9 IC5.9 | 14.88,11.1 12.83,13.16 | 12.83,13.16 10.77,13.16 10.31,12.7 10.31,9.73 IC5.1 10.08,9.73 6.66,9.73 6.43,9.96 C9.2 6.2,10.18 6.2,13.84 2.77,17.27 2.77,26.87 3.68,27.79 R5.1 3.91,28.02 5.05,29.16 D1.C 5.05,29.39 2.54,31.9 U$3.14 2.54,33.05 4.37,34.87 4.37,36.25 2.54,38.08 U$3.12 U$3.11 U$3.10 U$3.9
  Top 0.254: v36.14,26.19 36.14,24.36 IC2.10 | IC9.6 65.41,59.11 66.32,58.19 68.38,58.19 69.06,58.88 69.06,59.56 IC9.9 69.29,59.79 70.43,59.79 IC9.10 70.66,59.79 v73.18,59.79 | 83.92,62.31 83.92,67.11 C6.2 | 83.92,62.31 83.92,61.16 C5.2 84.15,60.94 88.04,57.05 90.09,57.05 IC6.1 | 83.92,62.31 80.26,62.31 79.81,61.85 79.81,54.76 U$2.25 | IC4.1 60.38,24.13 60.38,23.44 61.06,22.76 70.89,22.76 71.58,23.44 71.58,24.13 IC4.10 71.81,24.36 73.64,26.19 77.98,26.19 | 77.98,26.19 88.27,26.19 89.41,25.04 89.41,24.36 IC1.10 | IC3.9 52.83,24.13 53.98,24.13 IC3.10 v53.98,25.96 | IC4.19 61.75,34.19 62.66,34.19 IC4.18 62.89,34.19 64.03,34.19 IC4.17 64.26,34.19 65.41,34.19 | 65.41,34.19 66.55,34.19 IC4.15 66.78,34.19 66.78,33.27 69.29,30.76 73.86,30.76 74.78,31.67 74.78,32.82 C2.2 75.01,32.82 78.66,32.82 79.35,33.5 79.35,34.19 IC1.19 | 65.41,34.19 IC4.16 | v77.98,26.64 77.98,26.19 | C3.2 39.57,32.82 40.49,32.82 42.32,30.99 50.32,30.99 52.15,32.82 54.43,32.82 54.66,33.05 54.66,33.5 55.12,33.96 56.03,33.96 56.95,33.05 C1.2
  Bottom 0.254: JP2.6 57.17,79.91 57.17,77.62 JP2.5 57.17,77.39 58.55,76.02 60.38,76.02 60.83,76.48 71.81,76.48 72.26,76.02 v75.92,76.02 77.52,76.02 78.44,75.11 78.44,73.51 68.83,63.91 68.83,62.99 72.03,59.79 v73.18,59.79 74.09,60.71 75.01,60.71 79.81,55.91 79.81,54.76 U$2.25 79.81,54.53 79.81,43.79 75.92,39.9 75.92,33.96 75.01,33.05 C2.2 | C8.2 41.4,69.85 35.23,76.02 32.26,76.02 X1.6 | 36.14,29.62 v36.14,26.19 | 36.14,29.62 39.34,32.82 C3.2 | D1.C 5.28,29.39 6.2,30.3 17.17,30.3 19.68,32.82 20.14,32.82 C7.2 20.37,32.82 23.57,29.62 36.14,29.62 | v53.98,25.96 53.98,29.84 C1.2 57.17,33.05 74.78,33.05 C2.2 | U$1.20 91.24,3.79 90.55,3.79 89.41,2.64 78.21,2.64 77.52,3.33 77.52,23.44 77.98,23.9 v77.98,26.64 77.98,29.84 75.01,32.82 C2.2
HSYNC
  Top 0.254: U$2.36 52.15,54.76 52.15,60.94 R14.1
IRQ
  Top 0.254: IC7.1 25.4,9.5 23.34,9.5 17.86,4.01 R17.1
  Bottom 0.254: U$2.37 49.4,54.53 49.4,52.71 48.03,51.33 48.03,33.27 32.72,17.96 32.72,16.36 20.37,4.01 17.86,4.01 R17.1
LPB
  Top 0.254: IC3.12 52.83,34.42 52.83,35.1 55.35,37.62 60.6,37.62 62.2,39.22 U$2.17
MD0
  Top 0.254: R12.1 48.26,82.42 52.15,82.42 54.43,80.14 JP2.4
MD1
  Top 0.254: R15.1 49.63,71.22 49.63,72.59 54.43,77.39 JP2.3
N$1
  Top 0.254: IC7.2 26.54,9.5 26.54,8.81 25.17,7.44 24.26,7.44 23.57,6.76 23.57,3.33 24.71,2.18 59.23,2.18 60.83,3.79 U$1.8
N$2  (via drill 0.61)
  Top 0.254: v63.8,80.82 61.75,80.82 IC10.2 | v81.18,76.71 81.18,76.25 83.69,73.74 R10.1
  Bottom 0.254: v63.8,80.82 75.92,80.82 80.04,76.71 v81.18,76.71
N$4
  Bottom 0.254: U$2.24 80.04,39.45 90.09,39.45 D2.C
N$6
  Top 0.254: IC10.5 61.75,76.94 63.8,76.94 65.18,78.31 65.18,82.19 66.09,83.11 81.86,83.11 83.69,81.28 R7.1
N$7
  Top 0.254: U$3.1 R1.2 2.54,71.22 1.4,72.36 1.4,73.96 2.08,74.65 2.54,74.65 7.57,79.68 28.83,79.68 30.2,78.31 30.89,78.31 X1.1
N$8
  Top 0.254: IC7.4 29.06,9.5 29.06,8.81 26.77,6.53 25.4,6.53 JP1.2 JP1.1
N$9  (via drill 0.61)
  Top 0.254: v59.92,76.94 59.92,75.34 60.83,74.42 61.52,74.42 IC10.7
  Bottom 0.254: v59.92,76.94 79.12,76.94 80.26,75.79 81.64,75.79 83.69,77.85 83.69,78.54 R8.1
N$10
  Top 0.254: 4.14,71.91 2.54,73.51 R2.2 | 4.14,71.91 4.37,71.68 4.37,65.51 2.54,63.68 U$3.2 | 4.14,71.91 11.45,79.22 27,79.22 27.91,78.31 28.6,78.31 X1.2
N$11
  Top 0.254: IC10.10 67.92,74.42 68.61,74.42 70.21,76.02 70.21,80.82 72.03,82.65 80.49,82.65 82.78,80.37 82.78,77.16 83.69,76.25 R9.1
N$12
  Bottom 0.254: R14.2 44.37,61.16 36.37,61.16 26.54,70.99 26.54,74.19 X1.13
N$13
  Bottom 0.254: R13.2 38.43,58.42 24.26,72.59 24.26,74.19 X1.14
N$14
  Top 0.254: U$2.40 41.86,54.53 41.4,54.53 39.8,52.93 21.06,52.93 19.46,54.53 19.46,56.82 17.86,58.42 U$3.25
N$15
  Bottom 0.254: 4.37,74.19 4.37,62.99 2.54,61.16 U$3.3 | 4.37,74.19 2.54,76.02 R4.2 | 4.37,74.19 9.4,79.22 24.71,79.22 25.63,78.31 26.31,78.31 X1.3
N$16
  Top 0.254: IC8.1 11.68,39.9 11.68,35.56 16.94,30.3 16.94,25.5 15.8,24.36 8.71,24.36 7.8,25.27 R6.2 7.57,25.5 3.91,21.84 3.91,20.47 R5.2
N$17  (via drill 0.61)
  Top 0.254: v77.52,80.59 73.18,80.59 IC11.2
  Bottom 0.254: v77.52,80.59 83.01,80.59 83.46,80.14 93.98,80.14 95.12,81.28 R18.1
N$18
  Top 0.254: IC11.5 73.18,76.71 73.86,76.71 77.75,72.82 77.75,71.91 78.66,70.99 94.21,70.99 96.27,73.05 96.27,77.62 95.35,78.54 R19.1
N$19
  Top 0.254: R6.1 15.34,25.5 15.34,29.16 D1.A 15.11,29.39 15.11,31.45 9.86,36.7 9.86,41.28 | 6.43,41.28 6.43,42.42 IC8.6 | 11.45,41.28 11.45,42.42 IC8.3 | 11.45,41.28 9.86,41.28 | 9.86,41.28 6.43,41.28 | 6.43,41.28 IC8.7 | 11.45,41.28 IC8.2
N$21
  Top 0.254: U$3.4 4.37,56.59 4.37,54.3 11.45,47.22 11.45,44.02 IC8.4
N$23
  Top 0.254: IC11.7 73.18,74.19 74.78,74.19 78.44,70.54 94.44,70.54 96.72,72.82 96.72,78.77 95.58,79.91 94.89,79.91 94.21,79.22 94.21,77.16 95.12,76.25 R20.1
N$24
  Bottom 0.254: U$3.13 2.54,36.02 15.11,48.59 15.11,55.45 16.94,57.28 19.46,57.28 22.2,60.02 28.83,60.02 34.09,54.76 U$2.43
N$25
  Bottom 0.254: U$3.16 25.17,35.56 25.63,35.1 27.23,35.1 30.66,38.53 30.66,48.13 36.83,54.3 U$2.42
N$26
  Top 0.254: IC11.10 79.35,74.19 81.86,74.19 83.46,72.59 94.21,72.59 95.12,73.51 R21.1
N$28
  Bottom 0.254: U$3.15 17.63,33.05 17.63,33.5 16.03,35.1 16.03,36.02 16.71,36.7 25.4,36.7 26.31,37.62 27,37.62 27.69,38.3 27.69,51.33 25.17,53.85 25.17,56.13 22.88,58.42 R11.1
P0  (via drill 0.61)
  Top 0.254: U$2.48 22.66,55.68 | 22.66,55.68 23.34,56.36 25.4,56.36 30.2,61.16 35.92,61.16 37.97,63.22 37.97,66.19 47.8,76.02 52.15,76.02 53.29,77.16 53.29,77.62 54.2,78.54 57.17,78.54 57.86,79.22 61.52,79.22 IC10.3 61.75,79.45 v63.58,79.45 | v71.12,79.45 72.95,79.45 IC11.3 | v12.83,59.56 18.77,59.56 22.66,55.68
  Bottom 0.254: v63.58,79.45 v71.12,79.45 | v12.83,59.56 9.17,55.91 2.54,55.91 U$3.5
P1  (via drill 0.61)
  Top 0.254: v71.35,78.08 72.95,78.08 IC11.4 | IC10.4 61.75,78.08 v63.58,78.08 64.72,79.22 64.72,81.28 62.43,83.57 41.86,83.57 22.88,64.59 16.48,64.59 11.91,60.02 11.91,53.39 | 11.91,53.39 15.57,53.39 16.71,54.53 18.77,54.53 v21.29,52.02 | 11.91,53.39 v6.66,53.39
  Bottom 0.254: v71.35,78.08 v63.58,78.08 | v6.66,53.39 2.54,53.39 U$3.6 | v21.29,52.02 24.03,54.76 U$2.47
P2  (via drill 0.61)
  Top 0.254: v64.26,75.56 IC10.6 | IC11.6 v71.35,75.56 | v30.89,60.25 30.89,58.88 26.77,54.76 U$2.46
  Bottom 0.254: v71.35,75.56 v64.26,75.56 54.89,75.56 53.29,77.16 53.29,77.85 52.38,78.77 40.49,78.77 40.26,78.99 33.4,78.99 31.34,76.94 30.66,76.94 30.2,77.39 29.52,77.39 29.06,76.94 28.37,76.94 27.91,77.39 27.23,77.39 26.77,76.94 26.09,76.94 25.63,77.39 24.94,77.39 24.49,76.94 23.8,76.94 23.34,77.39 22.66,77.39 20.6,75.34 20.6,62.08 | 20.6,62.08 29.06,62.08 v30.89,60.25 | 20.6,62.08 16.71,62.08 5.51,50.88 2.54,50.88 U$3.7
P3  (via drill 0.61)
  Top 0.254: IC10.11 67.01,75.56 v66.09,74.65 | v77.52,74.65 78.44,75.56 IC11.11 | U$2.44 31.8,54.76 v31.8,58.42 33.86,58.42 37.74,62.31 v45.97,62.31
  Bottom 0.254: v77.52,74.65 v66.09,74.65 64.72,74.65 52.83,62.76 50.32,62.76 49.86,62.31 v45.97,62.31 | v31.8,58.42 31.34,58.42 29.29,60.48 21.97,60.48 21.29,59.79 16.94,59.79 5.51,48.36 2.54,48.36 U$3.8
PHI02  (via drill 0.61)
  Top 0.254: v11.23,12.24 11.23,9.73 IC5.2
  Bottom 0.254: v11.23,12.24 11.23,19.1 2.77,27.56 2.77,29.16 12.83,39.22 19.46,39.22 21.06,37.62 21.97,37.62 22.66,38.3 22.66,45.62 18.54,49.73 16.71,49.73 16.03,50.42 16.03,51.33 16.94,52.25 18.77,52.25 20.6,54.08 20.6,57.73 22.43,59.56 24.26,59.56 U$2.45
RAS  (via drill 0.61)
  Top 0.254: U$2.22 70.66,35.1 70.66,34.42 IC4.12 | v74.55,59.79 70.66,63.68 70.66,69.62 IC9.11
  Bottom 0.254: v74.55,59.79 78.66,55.68 78.66,43.33 74.78,39.45 U$2.22
RESET  (via drill 0.61)
  Top 0.254: v27.91,12.93 27.91,9.73 IC7.3 | v43.69,32.36 43.69,34.19 IC3.19 | v45.52,43.1 56.95,54.53 U$2.34
  Bottom 0.254: v27.91,12.93 27.91,20.24 R3.1 28.14,20.47 29.97,22.3 35.23,22.3 43.69,30.76 v43.69,32.36 45.52,34.19 v45.52,43.1
RWB
  Top 0.254: IC3.13 51.46,34.42 51.46,36.25 54.43,39.22 U$2.14
SYNCLK  (via drill 0.61)
  Top 0.254: v69.75,73.74 69.06,73.05 67.92,73.05 IC10.9 | v71.58,71.91 59,71.91 50.55,63.45 50.55,60.48 44.6,54.53 U$2.39
  Bottom 0.254: v71.58,71.91 v69.75,73.74
SYNLUM
  Top 0.254: R10.2 91.47,73.74 91.47,76.02 R9.2 91.47,76.25 91.47,78.54 R8.2 91.47,78.77 91.47,81.28 R7.2
  Bottom 0.254: U$1.15 78.89,4.01 78.89,7.44 90.09,18.64 90.09,37.62 91.47,38.99 91.47,73.51 R10.2
VA0
  Top 0.254: IC1.9 88.27,23.44 83.92,19.1 U$1.24
VA1
  Top 0.254: IC1.8 86.89,24.13 86.89,23.44 83.69,20.24 83.24,20.24 82.09,19.1 81.41,19.1 U$1.25
VA2
  Top 0.254: IC1.7 85.52,24.13 85.52,23.22 82.55,20.24 80.04,20.24 78.89,19.1 U$1.26
VA3
  Top 0.254: IC1.6 84.38,24.13 84.38,23.44 81.64,20.7 79.81,20.7 79.35,20.24 77.52,20.24 76.38,19.1 U$1.27
VA4
  Top 0.254: IC1.5 83.01,24.36 83.01,25.04 82.32,25.73 75.23,25.73 71.58,22.07 67.46,22.07 64.72,19.33 64.72,18.64 65.63,17.73 72.49,17.73 73.64,18.87 U$1.28
VA5
  Top 0.254: IC1.4 81.86,24.13 81.86,23.44 79.12,20.7 72.72,20.7 71.12,19.1 U$1.29
VA6
  Top 0.254: IC1.3 80.49,24.13 80.49,23.44 78.21,21.16 70.66,21.16 68.61,19.1 U$1.30
VA7
  Top 0.254: U$1.31 68.61,21.61 77.52,21.61 79.35,23.44 79.35,24.13 IC1.2
VA8  (via drill 0.61)
  Top 0.254: v60.15,64.36 60.15,69.62 IC9.19 | v52.83,31.45 55.12,31.45 v56.03,30.53
  Bottom 0.254: v60.15,64.36 55.35,59.56 54.2,59.56 51,56.36 51,52.93 49.63,51.56 49.63,46.3 53.06,42.88 53.06,31.67 v52.83,31.45 | v56.03,30.53 56.03,26.42 63.35,19.1 U$1.32
VA9  (via drill 0.61)
  Top 0.254: v61.06,65.96 61.52,66.42 61.52,69.62 IC9.18 | v58.09,63.68 58.09,55.91 58.32,55.68 58.32,49.28 v50.55,41.5
  Bottom 0.254: v61.06,65.96 60.38,65.96 v58.09,63.68 | v50.55,41.5 50.55,27.33 57.63,20.24 59.69,20.24 60.83,19.1 U$1.33
VA10  (via drill 0.61)
  Top 0.254: v61.06,63.45 62.66,65.05 62.66,69.62 IC9.17 | v48.95,44.93 v56.03,52.02
  Bottom 0.254: v61.06,63.45 61.06,60.71 56.03,55.68 v56.03,52.02 | v48.95,44.93 48.95,41.05 48.49,40.59 48.49,28.7 58.32,18.87 U$1.34
VA11  (via drill 0.61)
  Top 0.254: v69.75,63.45 64.26,68.94 64.26,69.62 IC9.16
  Bottom 0.254: v69.75,63.45 73.41,63.45 81.18,55.68 81.18,42.65 78.89,40.36 78.89,26.42 86.21,19.1 U$1.23
VAEC
  Top 0.254: IC4.6 66.55,24.36 66.55,25.04 65.86,25.73 59.92,25.73 59.46,25.27 59.46,22.3 62.2,19.56 62.2,17.04 75.01,4.24 75.01,3.33 75.69,2.64 80.04,2.64 81.18,3.79 U$1.16
VBA  (via drill 0.61)
  Top 0.254: v67.92,25.96 67.92,24.36 IC4.7
  Bottom 0.254: v67.92,25.96 67.92,21.39 69.98,19.33 69.98,5.16 71.12,4.01 U$1.12
VCAS  (via drill 0.61)
  Top 0.254: v90.09,13.16 90.09,19.33 90.32,19.56 90.32,25.27 88.04,27.56 77.52,27.56 76.84,26.87 72.49,26.87 70.66,25.04 70.66,24.36 IC4.9
  Bottom 0.254: v90.09,13.16 90.09,5.16 88.95,4.01 U$1.19
VCC  (via drill 0.61)
  Top 0.254: IC6.2 92.61,57.05 92.61,60.94 84.84,68.71 83.01,68.71 81.64,67.33 81.18,67.33 C6.1 80.95,67.33 75.46,67.33 | C8.1 53.52,64.82 58.32,69.62 59,69.62 IC9.20 59.23,69.85 59.23,70.54 59.92,71.22 70.89,71.22 74.78,67.33 75.46,67.33 | v66.09,81.74 67.69,81.74 IC10.16 | v75.01,81.74 79.12,81.74 IC11.16 | JP2.1 52.15,77.62 52.15,79.91 JP2.2 | R16.2 5.28,21.39 5.28,16.36 6.2,15.44 C9.1 6.43,15.44 6.66,15.67 10.08,15.67 IC5.14 10.31,15.67 11.23,15.67 IC5.13 11.45,15.9 11.45,16.36 12.83,17.73 20.14,17.73 | IC7.14 25.4,13.84 21.74,10.18 C4.1 | 20.14,17.73 20.14,20.24 R3.2 | 20.14,17.73 20.14,16.13 18.31,14.3 16.03,14.3 15.34,14.99 15.34,15.67 IC5.10 | v26.09,32.36 24.94,33.5 24.94,34.19 IC2.20 | 42.55,24.82 IC3.1 42.55,24.36 | 42.55,24.82 39.57,27.79 C3.1 | v41.17,34.19 42.55,34.19 IC3.20 | v60.38,32.13 60.38,34.19 IC4.20 60.38,34.42 60.38,34.87 61.29,35.79 63.35,35.79 65.86,38.3 65.86,55.45 66.78,56.36 72.49,56.36 75.46,59.33 75.46,67.33 | v73.86,32.13 73.86,33.5 74.55,34.19 77.98,34.19 IC1.20 | 42.55,24.82 45.52,27.79 56.95,27.79 C1.1
  Bottom 0.254: JP2.2 52.15,80.14 53.75,81.74 v66.09,81.74 v75.01,81.74 | JP2.1 54.43,75.11 54.43,69.39 53.52,68.48 53.52,64.82 C8.1 | R17.2 10.08,4.01 10.08,11.56 6.43,15.21 C9.1 | 20.37,25.27 20.37,20.47 R3.2 20.37,20.24 20.37,14.99 21.51,13.84 21.51,10.18 C4.1 | 20.37,25.27 20.37,27.79 C7.1 | v26.09,32.36 37.29,32.36 39.12,34.19 39.8,34.19 40.49,33.5 | 40.49,33.5 40.49,28.93 39.57,28.02 C3.1 39.34,27.79 36.83,25.27 20.37,25.27 | 40.49,33.5 v41.17,34.19 | C1.1 57.17,28.02 60.38,31.22 v60.38,32.13 68.83,32.13 69.29,32.59 73.41,32.59 v73.86,32.13 73.86,28.93 74.78,28.02 C2.1
VCLRCLK  (via drill 0.61)
  Top 0.254: v15.34,4.7 15.34,9.5 IC5.5
  Bottom 0.254: v15.34,4.7 17.86,2.18 91.47,2.18 92.61,3.33 92.61,17.73 91.47,18.87 U$1.21
VCSB
  Top 0.254: IC3.6 48.95,24.36 48.95,24.82 51,26.87 54.43,26.87 57.17,24.13 57.17,12.7 65.86,4.01 U$1.10
VD0
  Top 0.254: IC2.9 35,24.13 35,21.39 37.06,19.33 37.06,16.82 47.35,6.53 55.8,6.53 58.32,4.01 U$1.7
VD1
  Top 0.254: IC2.8 33.86,24.13 33.86,21.84 36.6,19.1 36.6,16.59 47.12,6.07 53.75,6.07 55.8,4.01 U$1.6
VD2
  Top 0.254: IC2.7 32.49,24.13 32.49,22.53 36.14,18.87 36.14,16.36 46.89,5.61 51.69,5.61 53.29,4.01 U$1.5
VD3  (via drill 0.61)
  Top 0.254: IC2.6 31.11,24.82 33.4,27.1 36.6,27.1 37.52,26.19 37.52,17.73 v47.8,7.44
  Bottom 0.254: v47.8,7.44 47.8,6.98 50.77,4.01 U$1.4
VD4  (via drill 0.61)
  Top 0.254: v31.8,21.39 29.97,23.22 29.97,24.13 IC2.5 | v31.8,17.96 32.72,17.96 41.86,8.81 41.86,2.87 42.09,2.64 44.14,2.64 44.37,2.87 44.37,4.24 45.29,5.16 47.12,5.16 48.26,4.01 U$1.3
  Bottom 0.254: v31.8,17.96 v31.8,21.39
VD5
  Top 0.254: U$1.2 46.89,2.64 59,2.64 59.69,3.33 59.69,4.24 56.95,6.98 53.52,6.98 37.97,22.53 37.97,26.42 36.83,27.56 31.34,27.56 28.6,24.82 28.6,24.36 IC2.4
VD6
  Top 0.254: IC2.3 27.46,24.13 27.46,23.44 29.06,21.84 29.97,21.84 32.49,19.33 35,19.33 35.69,18.64 35.69,15.67 43,8.36 43,4.01 U$1.1
VD7  (via drill 0.61)
  Top 0.254: v34.54,18.41 32.72,18.41 29.74,21.39 28.14,21.39 26.09,23.44 26.09,24.13 IC2.2
  Bottom 0.254: v34.54,18.41 42.09,18.41 42.77,17.73 44.37,17.73 45.52,18.87 U$1.39
VD8
  Top 0.254: IC3.2 43.92,24.13 43.92,23.44 48.26,19.1 U$1.38
VD9
  Top 0.254: IC3.3 45.29,24.13 45.29,23.22 48.26,20.24 49.63,20.24 50.77,19.1 U$1.37
VD10  (via drill 0.61)
  Top 0.254: v48.72,21.16 46.43,23.44 46.43,24.13 IC3.4
  Bottom 0.254: v48.72,21.16 51.23,21.16 U$1.36
VD11  (via drill 0.61)
  Top 0.254: v49.4,22.3 48.95,22.3 47.8,23.44 47.8,24.13 IC3.5
  Bottom 0.254: v49.4,22.3 52.6,22.3 55.8,19.1 U$1.35
VLPB
  Top 0.254: IC3.8 51.46,24.13 51.46,22.53 54.66,19.33 54.66,12.7 63.35,4.01 U$1.9
VPHI02
  Top 0.254: IC5.3 12.83,9.5 12.83,5.84 16.94,1.73 81.64,1.73 83.69,3.79 U$1.17
VRAS
  Top 0.254: IC4.8 69.06,24.36 69.06,26.19 68.38,26.87 60.38,26.87 59,25.5 59,20.24 59.69,19.56 59.69,17.04 72.49,4.24 72.49,3.33 73.64,2.18 81.41,2.18 82.55,3.33 82.55,4.24 83.46,5.16 85.07,5.16 86.21,4.01 U$1.18
VRWB
  Top 0.254: IC3.7 50.32,24.13 50.32,21.16 52.15,19.33 52.15,14.3 62.2,4.24 62.2,3.33 62.89,2.64 67.23,2.64 68.38,3.79 U$1.11
VSYNC
  Top 0.254: U$2.35 54.66,54.76 54.66,58.42 R13.1

### Text on the board
DrillLegend: LAYER-STACK
DrillLegend_01-16: 01-16
DrillLegend_01-20: 01-20